# Altium schematic sheet DDR&MIO.SchDoc
size A3
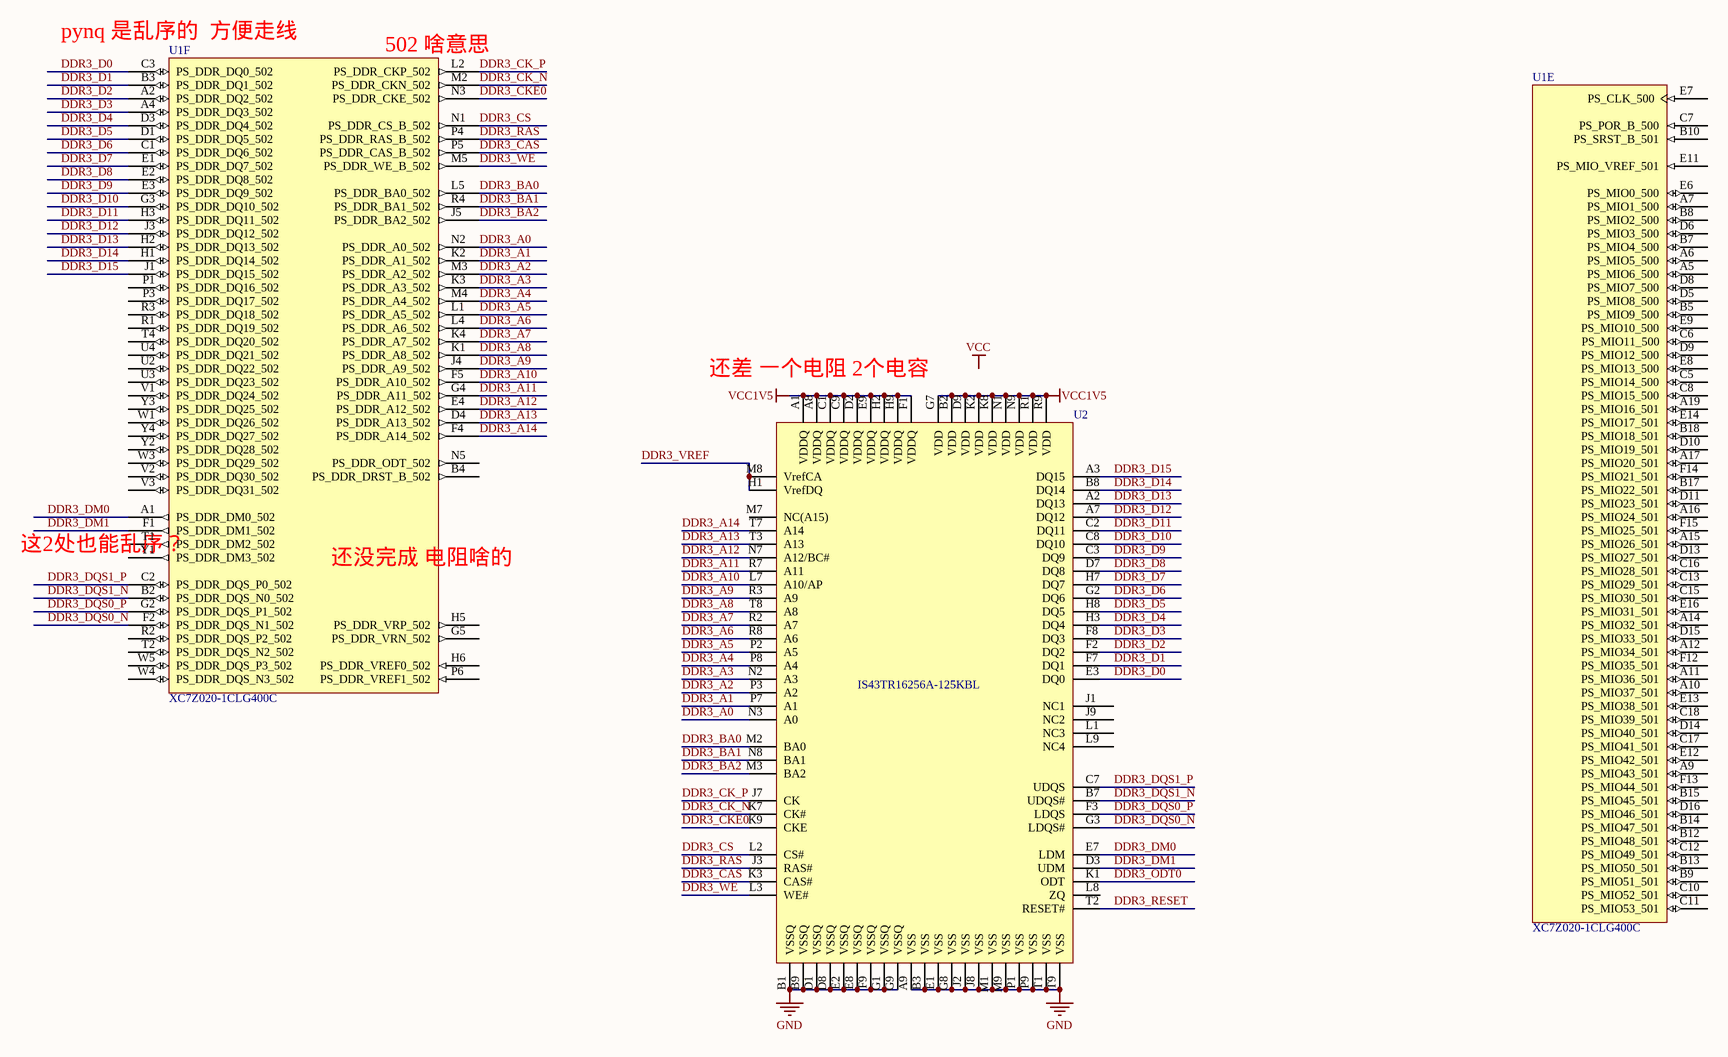
[diagram p0: DDR&MIO.SchDoc]

## Parts
U1  XC7Z020-1CLG400C  [CLG400]  (parts E,F of 9)
U2  IS43TR16256A-125KBL  [BGA96C80P16X9_1400X900X120]

## Nets
GND: U2.A9(VSS) U2.B1(VSSQ) U2.B3(VSS) U2.B9(VSSQ) U2.D1(VSSQ) U2.D8(VSSQ) U2.E1(VSS) U2.E2(VSSQ) U2.E8(VSSQ) U2.F9(VSSQ) U2.G1(VSSQ) U2.G8(VSS) U2.G9(VSSQ) U2.J2(VSS) U2.J8(VSS) U2.M1(VSS) U2.M9(VSS) U2.P1(VSS) U2.P9(VSS) U2.T1(VSS) U2.T9(VSS)
VCC1V5: U2.A1(VDDQ) U2.A8(VDDQ) U2.B2(VDD) U2.C1(VDDQ) U2.C9(VDDQ) U2.D2(VDDQ) U2.D9(VDD) U2.E9(VDDQ) U2.F1(VDDQ) U2.G7(VDD) U2.H2(VDDQ) U2.H9(VDDQ) U2.K2(VDD) U2.K8(VDD) U2.N1(VDD) U2.N9(VDD) U2.R1(VDD) U2.R9(VDD)
DDR3_A0: U1.N2(PS_DDR_A0_502) U2.N3(A0)
DDR3_A1: U1.K2(PS_DDR_A1_502) U2.P7(A1)
DDR3_A2: U1.M3(PS_DDR_A2_502) U2.P3(A2)
DDR3_A3: U1.K3(PS_DDR_A3_502) U2.N2(A3)
DDR3_A4: U1.M4(PS_DDR_A4_502) U2.P8(A4)
DDR3_A5: U1.L1(PS_DDR_A5_502) U2.P2(A5)
DDR3_A6: U1.L4(PS_DDR_A6_502) U2.R8(A6)
DDR3_A7: U1.K4(PS_DDR_A7_502) U2.R2(A7)
DDR3_A8: U1.K1(PS_DDR_A8_502) U2.T8(A8)
DDR3_A9: U1.J4(PS_DDR_A9_502) U2.R3(A9)
DDR3_A10: U1.F5(PS_DDR_A10_502) U2.L7(A10/AP)
DDR3_A11: U1.G4(PS_DDR_A11_502) U2.R7(A11)
DDR3_A12: U1.E4(PS_DDR_A12_502) U2.N7(A12/BC#)
DDR3_A13: U1.D4(PS_DDR_A13_502) U2.T3(A13)
DDR3_A14: U1.F4(PS_DDR_A14_502) U2.T7(A14)
DDR3_BA0: U1.L5(PS_DDR_BA0_502) U2.M2(BA0)
DDR3_BA1: U1.R4(PS_DDR_BA1_502) U2.N8(BA1)
DDR3_BA2: U1.J5(PS_DDR_BA2_502) U2.M3(BA2)
DDR3_CAS: U1.P5(PS_DDR_CAS_B_502) U2.K3(CAS#)
DDR3_CK_N: U1.M2(PS_DDR_CKN_502) U2.K7(CK#)
DDR3_CK_P: U1.L2(PS_DDR_CKP_502) U2.J7(CK)
DDR3_CKE0: U1.N3(PS_DDR_CKE_502) U2.K9(CKE)
DDR3_CS: U1.N1(PS_DDR_CS_B_502) U2.L2(CS#)
DDR3_D0: U1.C3(PS_DDR_DQ0_502) U2.E3(DQ0)
DDR3_D1: U1.B3(PS_DDR_DQ1_502) U2.F7(DQ1)
DDR3_D2: U1.A2(PS_DDR_DQ2_502) U2.F2(DQ2)
DDR3_D3: U1.A4(PS_DDR_DQ3_502) U2.F8(DQ3)
DDR3_D4: U1.D3(PS_DDR_DQ4_502) U2.H3(DQ4)
DDR3_D5: U1.D1(PS_DDR_DQ5_502) U2.H8(DQ5)
DDR3_D6: U1.C1(PS_DDR_DQ6_502) U2.G2(DQ6)
DDR3_D7: U1.E1(PS_DDR_DQ7_502) U2.H7(DQ7)
DDR3_D8: U1.E2(PS_DDR_DQ8_502) U2.D7(DQ8)
DDR3_D9: U1.E3(PS_DDR_DQ9_502) U2.C3(DQ9)
DDR3_D10: U1.G3(PS_DDR_DQ10_502) U2.C8(DQ10)
DDR3_D11: U1.H3(PS_DDR_DQ11_502) U2.C2(DQ11)
DDR3_D12: U1.J3(PS_DDR_DQ12_502) U2.A7(DQ12)
DDR3_D13: U1.H2(PS_DDR_DQ13_502) U2.A2(DQ13)
DDR3_D14: U1.H1(PS_DDR_DQ14_502) U2.B8(DQ14)
DDR3_D15: U1.J1(PS_DDR_DQ15_502) U2.A3(DQ15)
DDR3_DM0: U1.A1(PS_DDR_DM0_502) U2.E7(LDM)
DDR3_DM1: U1.F1(PS_DDR_DM1_502) U2.D3(UDM)
DDR3_DQS0_N: U1.F2(PS_DDR_DQS_N1_502) U2.G3(LDQS#)
DDR3_DQS0_P: U1.G2(PS_DDR_DQS_P1_502) U2.F3(LDQS)
DDR3_DQS1_N: U1.B2(PS_DDR_DQS_N0_502) U2.B7(UDQS#)
DDR3_DQS1_P: U1.C2(PS_DDR_DQS_P0_502) U2.C7(UDQS)
DDR3_ODT0: U2.K1(ODT)
DDR3_RAS: U1.P4(PS_DDR_RAS_B_502) U2.J3(RAS#)
DDR3_RESET: U2.T2(RESET#)
DDR3_VREF: U2.H1(VrefDQ) U2.M8(VrefCA)
DDR3_WE: U1.M5(PS_DDR_WE_B_502) U2.L3(WE#)

Not connected (* = marked no-connect by the designer): U1 A5(PS_MIO6_500) A6(PS_MIO5_500) A7(PS_MIO1_500) A9(PS_MIO43_501) A10(PS_MIO37_501) A11(PS_MIO36_501) A12(PS_MIO34_501) A14(PS_MIO32_501) A15(PS_MIO26_501) A16(PS_MIO24_501) A17(PS_MIO20_501) A19(PS_MIO16_501) B4(PS_DDR_DRST_B_502) B5(PS_MIO9_500) B7(PS_MIO4_500) B8(PS_MIO2_500) B9(PS_MIO51_501) B10(PS_SRST_B_501) B12(PS_MIO48_501) B13(PS_MIO50_501) B14(PS_MIO47_501) B15(PS_MIO45_501) B17(PS_MIO22_501) B18(PS_MIO18_501) C5(PS_MIO14_500) C6(PS_MIO11_500) C7(PS_POR_B_500) C8(PS_MIO15_500) C10(PS_MIO52_501) C11(PS_MIO53_501) C12(PS_MIO49_501) C13(PS_MIO29_501) C15(PS_MIO30_501) C16(PS_MIO28_501) C17(PS_MIO41_501) C18(PS_MIO39_501) D5(PS_MIO8_500) D6(PS_MIO3_500) D8(PS_MIO7_500) D9(PS_MIO12_500) D10(PS_MIO19_501) D11(PS_MIO23_501) D13(PS_MIO27_501) D14(PS_MIO40_501) D15(PS_MIO33_501) D16(PS_MIO46_501) E6(PS_MIO0_500) E7(PS_CLK_500) E8(PS_MIO13_500) E9(PS_MIO10_500) E11(PS_MIO_VREF_501) E12(PS_MIO42_501) E13(PS_MIO38_501) E14(PS_MIO17_501) E16(PS_MIO31_501) F12(PS_MIO35_501) F13(PS_MIO44_501) F14(PS_MIO21_501) F15(PS_MIO25_501) G5(PS_DDR_VRN_502) H5(PS_DDR_VRP_502) H6(PS_DDR_VREF0_502) N5(PS_DDR_ODT_502) P1(PS_DDR_DQ16_502) P3(PS_DDR_DQ17_502) P6(PS_DDR_VREF1_502) R1(PS_DDR_DQ19_502) R2(PS_DDR_DQS_P2_502) R3(PS_DDR_DQ18_502) T1(PS_DDR_DM2_502) T2(PS_DDR_DQS_N2_502) T4(PS_DDR_DQ20_502) U2(PS_DDR_DQ22_502) U3(PS_DDR_DQ23_502) U4(PS_DDR_DQ21_502) V1(PS_DDR_DQ24_502) V2(PS_DDR_DQ30_502) V3(PS_DDR_DQ31_502) W1(PS_DDR_DQ26_502) W3(PS_DDR_DQ29_502) W4(PS_DDR_DQS_N3_502) W5(PS_DDR_DQS_P3_502) Y1(PS_DDR_DM3_502) Y2(PS_DDR_DQ28_502) Y3(PS_DDR_DQ25_502) Y4(PS_DDR_DQ27_502); U2 J1(NC1) J9(NC2) L1(NC3) L8(ZQ) L9(NC4) M7(NC(A15))

## Notes on the sheet
- (near U1) pynq 是乱序的  方便走线
- (near U1) 502 啥意思
- (near U2) 还差 一个电阻 2个电容
- 这2处也能乱序？
- (near U1) 还没完成 电阻啥的
- Labels drawn without touching a wire or pin: VCC

## Library data of the parts
U1 = XC7Z020-1CLG400C: 667 MHz Zynq?7000 AP SoC, 130 PS I/O, 125 FPGA I/O, 400-Ball BGA, Speed Grade 1, Commercial Grade, Pb-Free; Manufacturer: Xilinx; Extensible Block RAM (# 36Kb Blocks): 560 KB (140); Flip Flops: 106400; LUTs: 53200; Speed Grade: -1; DatasheetVersion: v1.2; PackageVersion: Rev 1.1; PackageReference: CLG400; PackageDescription: Wire-Bond Chip-Scale BGA, Body 17 x 17 mm, 0.8 mm Pitch; Generic Part Number: XC7Z020; RoHS: Pb-Free; Mounting Technology: Surface Mount; Code_JEDEC: MO-275-MMAA-1; PartNumber: XC7Z020-1CLG400C; ComponentLink1Description: Datasheet; ComponentLink1URL: http://www.xilinx.com/support/documentation/data_sheets/ds190-Zynq-7000-Overview.pdf; ComponentLink2Description: Package Specification; ComponentLink2URL: http://www.xilinx.com/support/documentation/user_guides/ug865-Zynq-7000-Pkg-Pinout.pdf; ComponentLink3Description: DC and AC Switching Characteristics; ComponentLink3URL: http://www.xilinx.com/support/documentation/data_sheets/ds187-XC7Z010-XC7Z020-Data-Sheet.pdf; ComponentLink4Description: Package File; ComponentLink4URL: http://www.xilinx.com/support/packagefiles/z7packages/xc7z020clg400pkg.txt; ComponentLink5Description: Packaging and Pinout; ComponentLink5URL: http://www.xilinx.com/support/documentation/user_guides/ug865-Zynq-7000-Pkg-Pinout.pdf; ComponentLink6Description: PCB and Layout Guide; ComponentLink6URL: http://www.xilinx.com/support/documentation/user_guides/ug483_7Series_PCB.pdf
U2 = IS43TR16256A-125KBL: 与MT41K256M16HA-125IT完全兼容